# EAGLE board csa_vdc_v1.3e (EAGLE 4.15)
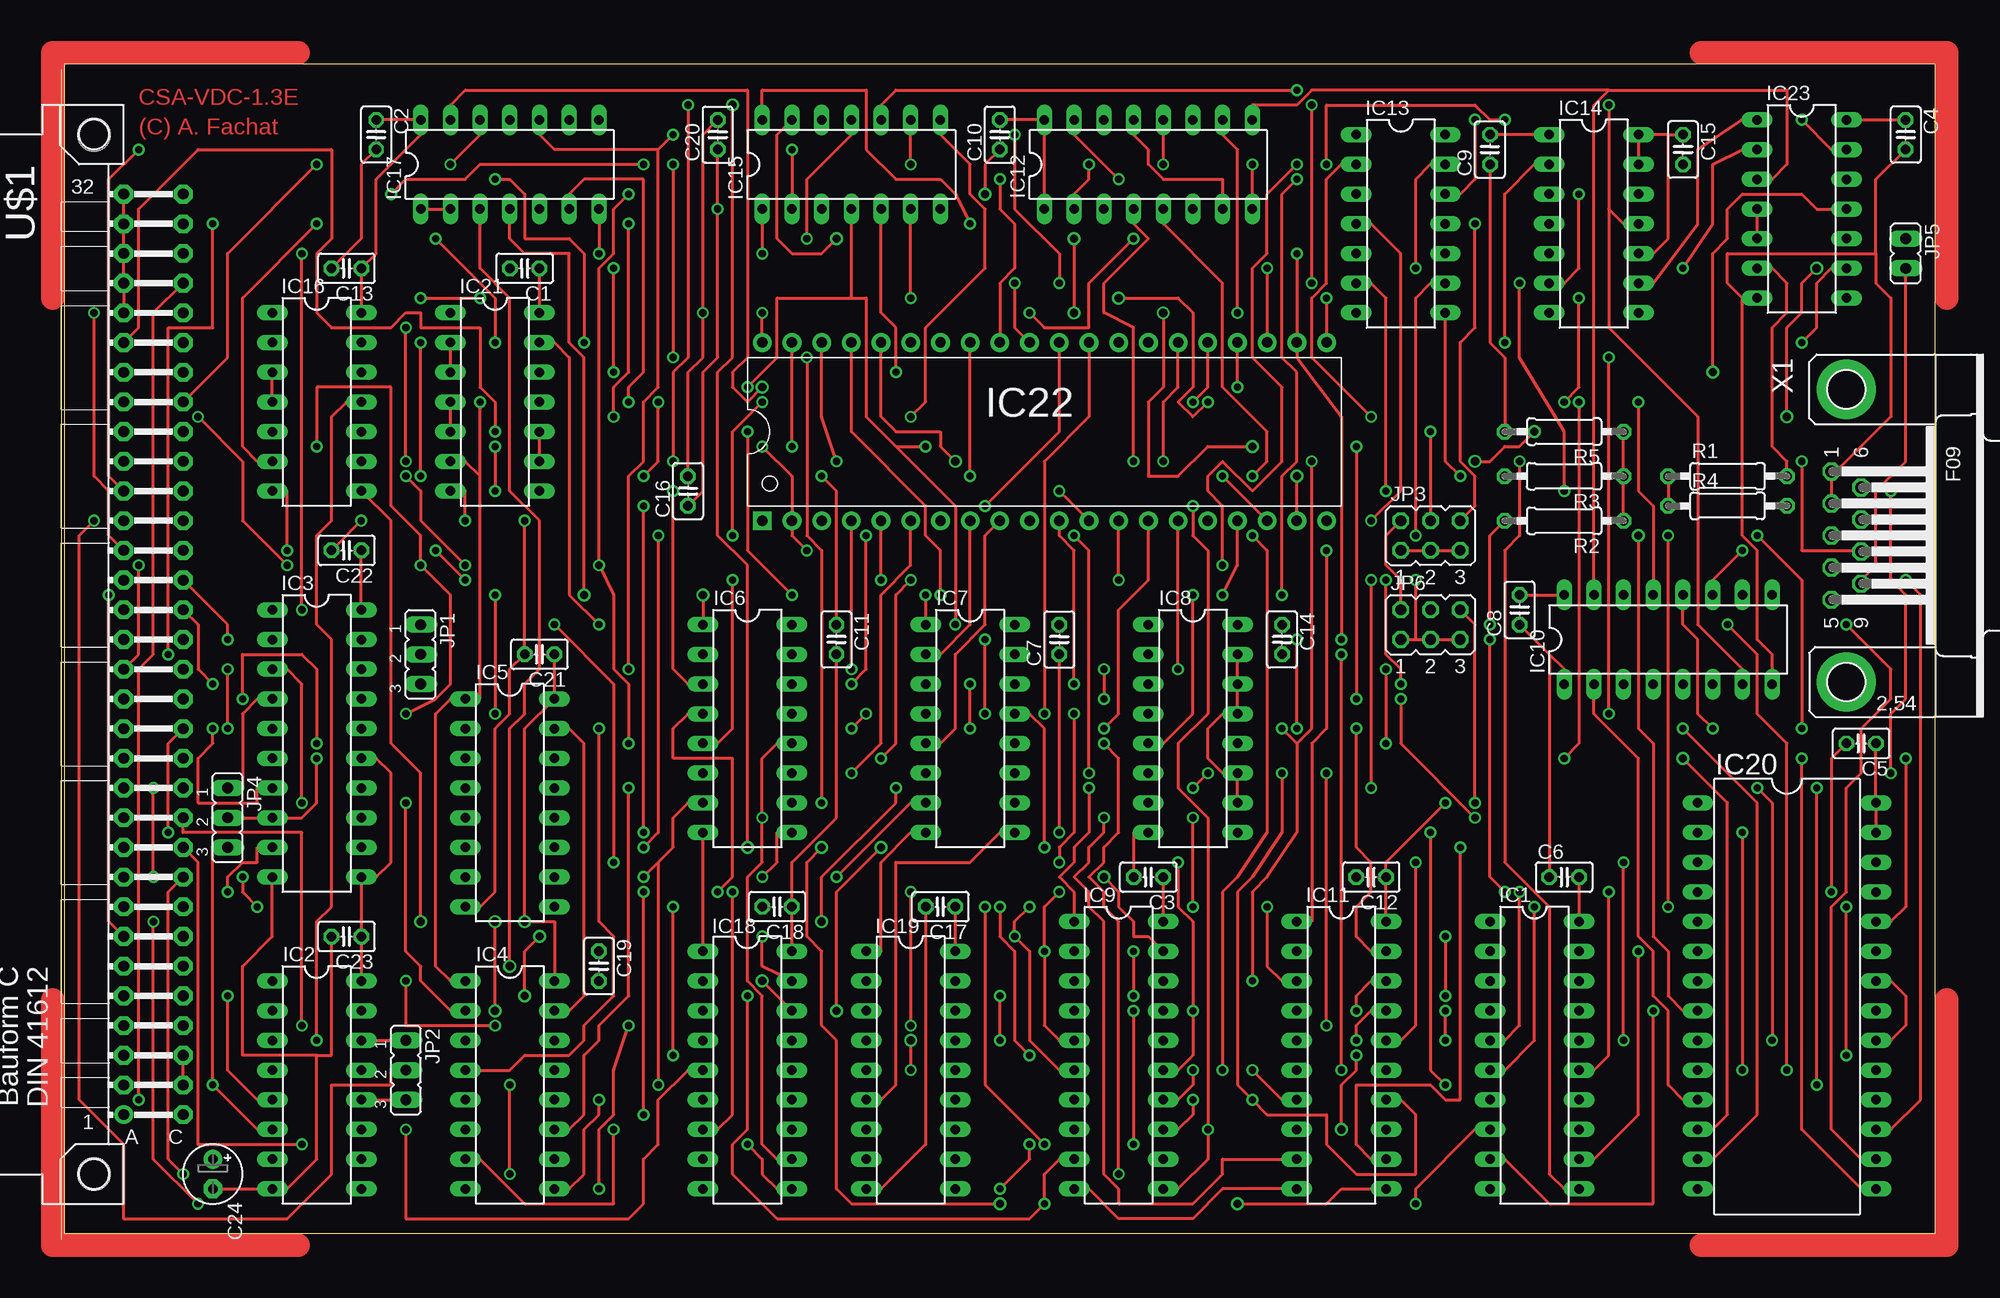
[diagram p1: board, top side]
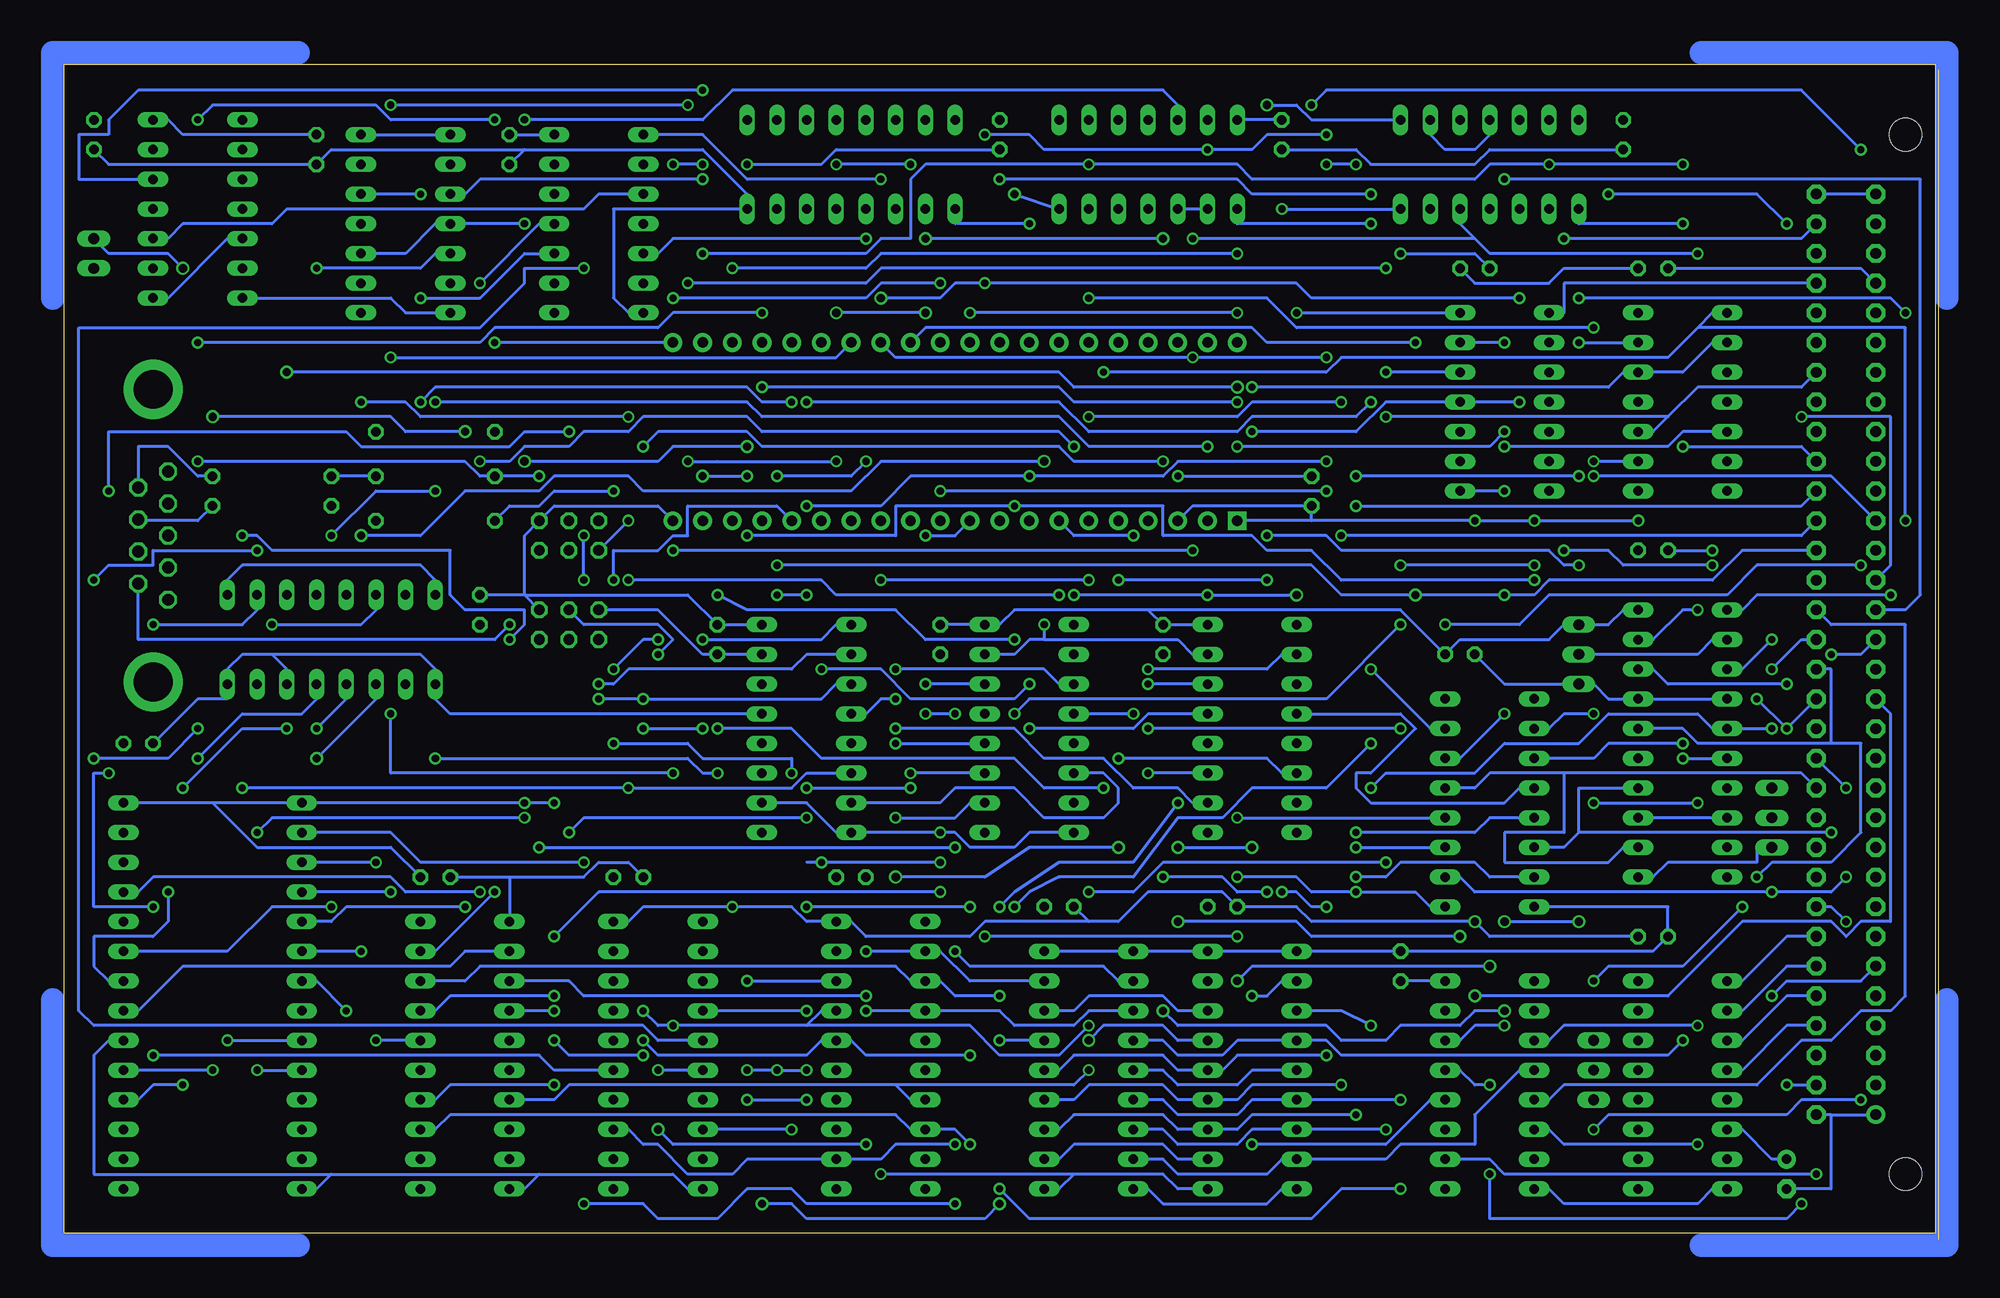
[diagram p2: board, bottom side, seen from below]

Size 160 x 100 mm. Coordinates in mm from the lower left corner, seen from the top.
Outline: 0,0 160,0 160,100 0,100 0,0
Copper layers (1*16): Top 0.035mm / dielectric 1.5mm / Bottom 0.035mm
Design rules "default": minimum track width 10mil, minimum drill 24mil, track to track 8mil, track to pad 8mil, pad to pad 8mil, via to via 8mil, smd to smd 8mil, copper to edge 40mil, drill to drill 8mil, minimum pad ring 10mil, minimum via ring 8mil, stop-mask expansion 4mil, vias tented up to drill 0mil, thermal gap 10mil

## Footprints (pad centres in the part's own frame; a part is rotated, then mirrored left to right if it is on the bottom)
C025-025X050 = drill 0.813 octagon: 1 -1.27,0; 2 1.27,0
E2,5-5 = drill 0.813 pad 1.6 round: + -1.27,0 | drill 0.813 pad 1.6 octagon: - 1.27,0
DIL20 = drill 0.813 long: 1 -11.43,-3.81; 2 -8.89,-3.81; 3 -6.35,-3.81; 4 -3.81,-3.81; 5 -1.27,-3.81; 6 1.27,-3.81; 7 3.81,-3.81; 8 6.35,-3.81; 9 8.89,-3.81; 10 11.43,-3.81; 11 11.43,3.81; 12 8.89,3.81; 13 6.35,3.81; 14 3.81,3.81; 15 1.27,3.81; 16 -1.27,3.81; 17 -3.81,3.81; 18 -6.35,3.81; 19 -8.89,3.81; 20 -11.43,3.81
DIL16 = drill 0.813 long: 1 -8.89,-3.81; 2 -6.35,-3.81; 3 -3.81,-3.81; 4 -1.27,-3.81; 5 1.27,-3.81; 6 3.81,-3.81; 7 6.35,-3.81; 8 8.89,-3.81; 9 8.89,3.81; 10 6.35,3.81; 11 3.81,3.81; 12 1.27,3.81; 13 -1.27,3.81; 14 -3.81,3.81; 15 -6.35,3.81; 16 -8.89,3.81
DIL20' = drill 0.813 long: 1 -10.16,-3.81; 2 -7.62,-3.81; 3 -5.08,-3.81; 4 -2.54,-3.81; 5 0,-3.81; 6 2.54,-3.81; 7 5.08,-3.81; 8 7.62,-3.81; 9 10.16,-3.81; 10 12.7,-3.81; 11 12.7,3.81; 12 10.16,3.81; 13 7.62,3.81; 14 5.08,3.81; 15 2.54,3.81; 16 0,3.81; 17 -2.54,3.81; 18 -5.08,3.81; 19 -7.62,3.81; 20 -10.16,3.81
DIL14 = drill 0.813 long: 1 -7.62,-3.81; 2 -5.08,-3.81; 3 -2.54,-3.81; 4 0,-3.81; 5 2.54,-3.81; 6 5.08,-3.81; 7 7.62,-3.81; 8 7.62,3.81; 9 5.08,3.81; 10 2.54,3.81; 11 0,3.81; 12 -2.54,3.81; 13 -5.08,3.81; 14 -7.62,3.81
DIL18 = drill 0.813 long: 1 -10.16,-3.81; 2 -7.62,-3.81; 3 -5.08,-3.81; 4 -2.54,-3.81; 5 0,-3.81; 6 2.54,-3.81; 7 5.08,-3.81; 8 7.62,-3.81; 9 10.16,-3.81; 10 10.16,3.81; 11 7.62,3.81; 12 5.08,3.81; 13 2.54,3.81; 14 0,3.81; 15 -2.54,3.81; 16 -5.08,3.81; 17 -7.62,3.81; 18 -10.16,3.81
DIL28-6 = drill 0.813 long: 1 -16.51,-7.62; 2 -13.97,-7.62; 3 -11.43,-7.62; 4 -8.89,-7.62; 5 -6.35,-7.62; 6 -3.81,-7.62; 7 -1.27,-7.62; 8 1.27,-7.62; 9 3.81,-7.62; 10 6.35,-7.62; 11 8.89,-7.62; 12 11.43,-7.62; 13 13.97,-7.62; 14 16.51,-7.62; 15 16.51,7.62; 16 13.97,7.62; 17 11.43,7.62; 18 8.89,7.62; 19 6.35,7.62; 20 3.81,7.62; 21 1.27,7.62; 22 -1.27,7.62; 23 -3.81,7.62; 24 -6.35,7.62; 25 -8.89,7.62; 26 -11.43,7.62; 27 -13.97,7.62; 28 -16.51,7.62
DIP40 = drill 0.889 pad 1.6 square: 1 -24.13,-7.62 | drill 0.889 pad 1.6 round: 2 -21.59,-7.62; 3 -19.05,-7.62; 4 -16.51,-7.62; 5 -13.97,-7.62; 6 -11.43,-7.62; 7 -8.89,-7.62; 8 -6.35,-7.62; 9 -3.81,-7.62; 10 -1.27,-7.62; 11 1.27,-7.62; 12 3.81,-7.62; 13 6.35,-7.62; 14 8.89,-7.62; 15 11.43,-7.62; 16 13.97,-7.62; 17 16.51,-7.62; 18 19.05,-7.62; 19 21.59,-7.62; 20 24.13,-7.62; 21 24.13,7.62; 22 21.59,7.62; 23 19.05,7.62; 24 16.51,7.62; 25 13.97,7.62; 26 11.43,7.62; 27 8.89,7.62; 28 6.35,7.62; 29 3.81,7.62; 30 1.27,7.62; 31 -1.27,7.62; 32 -3.81,7.62; 33 -6.35,7.62; 34 -8.89,7.62; 35 -11.43,7.62; 36 -13.97,7.62; 37 -16.51,7.62; 38 -19.05,7.62; 39 -21.59,7.62; 40 -24.13,7.62
JP2 = drill 0.914 long: 1 -2.54,0; 2 0,0; 3 2.54,0
JP3Q = drill 0.914 octagon: 1 -2.54,-1.27; 2 -2.54,1.27; 3 0,-1.27; 4 0,1.27; 5 2.54,-1.27; 6 2.54,1.27
JP1 = drill 0.914 long: 1 0,-1.27; 2 0,1.27
0207/10 = drill 0.813 octagon: 1 -5.08,0; 2 5.08,0
CSABUS = drill 0.914 pad 1.6 round: A1 7.62,36.83 | drill 0.914 pad 1.6 octagon: A2 7.62,34.29; A3 7.62,31.75; A4 7.62,29.21; A5 7.62,26.67; A6 7.62,24.13; A7 7.62,21.59; A8 7.62,19.05; A9 7.62,16.51; A10 7.62,13.97; A11 7.62,11.43; A12 7.62,8.89; A13 7.62,6.35; A14 7.62,3.81; A15 7.62,1.27; A16 7.62,-1.27; A17 7.62,-3.81; A18 7.62,-6.35; A19 7.62,-8.89; A20 7.62,-11.43; A21 7.62,-13.97; A22 7.62,-16.51; A23 7.62,-19.05; A24 7.62,-21.59; A25 7.62,-24.13; A26 7.62,-26.67; A27 7.62,-29.21; A28 7.62,-31.75; A29 7.62,-34.29; A30 7.62,-36.83; A31 7.62,-39.37; A32 7.62,-41.91; C1 2.54,36.83; C2 2.54,34.29; C3 2.54,31.75; C4 2.54,29.21; C5 2.54,26.67; C6 2.54,24.13; C7 2.54,21.59; C8 2.54,19.05; C9 2.54,16.51; C10 2.54,13.97; C11 2.54,11.43; C12 2.54,8.89; C13 2.54,6.35; C14 2.54,3.81; C15 2.54,1.27; C16 2.54,-1.27; C17 2.54,-3.81; C18 2.54,-6.35; C19 2.54,-8.89; C20 2.54,-11.43; C21 2.54,-13.97; C22 2.54,-16.51; C23 2.54,-19.05; C24 2.54,-21.59; C25 2.54,-24.13; C26 2.54,-26.67; C27 2.54,-29.21; C28 2.54,-31.75; C29 2.54,-34.29; C30 2.54,-36.83; C31 2.54,-39.37; C32 2.54,-41.91 | hole 2.794: 10.16,41.91; 10.16,-46.99
F09HP = drill 1.016 octagon: 1 -5.486,-1.27; 2 -2.743,-1.27; 3 0,-1.27; 4 2.743,-1.27; 5 5.486,-1.27; 6 -4.115,1.27; 7 -1.372,1.27; 8 1.372,1.27; 9 4.115,1.27 | drill 3.302 pad 5.08 round: G1 -12.522,0; G2 12.522,0

## Placement (x,y rotation side)
C1  [C025-025X050]  39.37,82.55 180 top
C2  [C025-025X050]  26.67,93.98 270 top
C3  [C025-025X050]  92.71,30.48 180 top
C4  [C025-025X050]  157.48,93.98 270 top
C5  [C025-025X050]  153.67,41.91 180 top
C6  [C025-025X050]  128.27,30.48 0 top
C7  [C025-025X050]  85.09,50.8 90 top
C8  [C025-025X050]  124.46,53.34 90 top
C9  [C025-025X050]  121.92,92.71 90 top
C10  [C025-025X050]  80.01,93.98 90 top
C11  [C025-025X050]  66.04,50.8 270 top
C12  [C025-025X050]  111.76,30.48 180 top
C13  [C025-025X050]  24.13,82.55 180 top
C14  [C025-025X050]  104.14,50.8 270 top
C15  [C025-025X050]  138.43,92.71 270 top
C16  [C025-025X050]  53.34,63.5 90 top
C17  [C025-025X050]  74.93,27.94 180 top
C18  [C025-025X050]  60.96,27.94 180 top
C19  [C025-025X050]  45.72,22.86 270 top
C20  [C025-025X050]  55.88,93.98 90 top
C21  [C025-025X050]  40.64,49.53 180 top
C22  [C025-025X050]  24.13,58.42 180 top
C23  [C025-025X050]  24.13,25.4 180 top
C24  [E2,5-5]  12.7,5.08 270 top
IC1  74HC374N  [DIL20]  125.73,15.24 270 top
IC2  74HCT138N  [DIL16]  21.59,12.7 270 top
IC3  74LS688BUSOPT  [DIL20']  21.59,43.18 270 top
IC4  74HCT257N  [DIL16]  38.1,12.7 270 top
IC5  74HCT257N  [DIL16]  38.1,36.83 270 top
IC6  74HCT257N  [DIL16]  58.42,43.18 270 top
IC7  74HCT257N  [DIL16]  77.47,43.18 270 top
IC8  74HCT257N  [DIL16]  96.52,43.18 270 top
IC9  74HCT245N  [DIL20]  90.17,15.24 270 top
IC10  74HCT166N  [DIL16]  137.16,50.8 0 top
IC11  74LS273BUSOPT  [DIL20']  109.22,16.51 270 top
IC12  74HCT175N  [DIL16]  92.71,91.44 0 top
IC13  74LS86N  [DIL14]  114.3,86.36 270 top
IC14  74HCT74N  [DIL14]  130.81,86.36 270 top
IC15  74HCT04N  [DIL14]  67.31,91.44 0 top
IC16  74HCT00N  [DIL14]  21.59,71.12 270 top
IC17  74LS32N  [DIL14]  38.1,91.44 0 top
IC18  [DIL18]  58.42,13.97 270 top
IC19  [DIL18]  72.39,13.97 270 top
IC20  27C64P  [DIL28-6]  147.32,20.32 270 top
IC21  74HCT04N  [DIL14]  36.83,71.12 270 top
IC22  CRTC6545SMALLPADS  [DIP40]  83.82,68.58 0 top
IC23  74HCT00N  [DIL14]  148.59,87.63 270 top
JP1  [JP2]  30.48,49.53 270 top
JP2  [JP2]  29.21,13.97 270 top
JP3  [JP3Q]  116.84,59.69 0 top
JP4  [JP2]  13.97,35.56 270 top
JP5  [JP1]  157.48,83.82 180 top
JP6  [JP3Q]  116.84,52.07 0 top
R1  10  [0207/10]  142.24,64.77 0 top
R2  47  [0207/10]  128.27,60.96 180 top
R3  47  [0207/10]  128.27,64.77 180 top
R4  220  [0207/10]  142.24,62.23 0 top
R5  220  [0207/10]  128.27,68.58 180 top
U$1  CSABUS  [CSABUS]  12.7,46.99 180 top
X1  [F09HP]  152.4,59.69 270 top

## Tracks (layer width: path | path; a pad name or v marks a point on that pad's centre or on a via)
2PHI2  (via drill 0.61)
  Top 0.254: v29.21,8.89 29.21,1.27 48.26,1.27 49.53,2.54 49.53,6.35 50.8,7.62 50.8,11.43 53.34,13.97 IC18.5 | v6.35,11.43 6.35,48.26 7.62,49.53 7.62,78.74 U$1.C29
  Bottom 0.254: IC18.5 58.42,13.97 59.69,12.7 64.77,12.7 66.04,13.97 IC19.5 | U$1.C29 31.75,81.28 31.75,78.74 IC21.1 | v29.21,8.89 27.94,10.16 12.7,10.16 11.43,11.43 v6.35,11.43
8PHI2  (via drill 0.61)
  Top 0.254: v36.83,76.2 36.83,80.01 v31.75,85.09 | v105.41,90.17 104.14,88.9 104.14,74.93 105.41,73.66 105.41,66.04 104.14,64.77 v104.14,54.61 | v78.74,44.45 v78.74,50.8 | v45.72,52.07 43.18,54.61 43.18,74.93 41.91,76.2 IC21.13
  Bottom 0.254: v31.75,85.09 11.43,85.09 U$1.C31 | v36.83,76.2 IC21.13 | v105.41,90.17 124.46,90.17 125.73,88.9 IC14.3 | v104.14,54.61 101.6,53.34 88.9,53.34 86.36,50.8 v78.74,50.8 | v78.74,44.45 77.47,45.72 52.07,45.72 v45.72,52.07
/8PHI2  (via drill 0.61)
  Top 0.254: v46.99,73.66 v46.99,82.55 | v106.68,81.28 v106.68,96.52 | v132.08,96.52 132.08,87.63 | 132.08,87.63 133.35,86.36 IC14.11 | 132.08,87.63 132.08,77.47 139.7,69.85 139.7,52.07 143.51,48.26 IC10.7
  Bottom 0.254: v46.99,82.55 90.17,82.55 91.44,81.28 v106.68,81.28 | v106.68,96.52 v132.08,96.52 | IC21.12 v46.99,73.66
//PHI2  (via drill 0.61)
  Top 0.254: v124.46,66.04 124.46,59.69 123.19,58.42 123.19,31.75 127,27.94 127,5.08 128.27,3.81 IC1.11 | 71.12,67.31 68.58,69.85 68.58,80.01 67.31,80.01 | v58.42,72.39 60.96,74.93 60.96,80.01 67.31,80.01 | 67.31,80.01 IC15.4 | v76.2,52.07 76.2,62.23 71.12,67.31 | 71.12,67.31 v73.66,67.31
  Bottom 0.254: 76.2,50.8 77.47,50.8 78.74,49.53 IC7.15 | 76.2,50.8 64.77,50.8 63.5,49.53 IC6.15 | IC16.2 19.05,76.2 21.59,73.66 IC16.12 26.67,73.66 27.94,72.39 v58.42,72.39 | v124.46,66.04 121.92,66.04 120.65,67.31 116.84,67.31 115.57,68.58 111.76,68.58 110.49,69.85 101.6,69.85 100.33,68.58 74.93,68.58 v73.66,67.31 | v76.2,52.07 76.2,50.8
/CAS  (via drill 0.7)
  Top 0.254: v59.69,21.59 IC18.16 | v38.1,22.86 38.1,43.18 39.37,44.45 39.37,46.99 40.64,48.26 40.64,60.96 38.1,63.5 38.1,80.01 35.56,82.55 IC17.3
  Bottom 0.254: IC18.16 64.77,19.05 66.04,20.32 72.39,20.32 73.66,19.05 IC19.16 | v59.69,21.59 58.42,22.86 v38.1,22.86
/CPURAM  (via drill 0.7)
  Top 0.254: IC16.8 27.94,60.96 27.94,41.91 30.48,39.37 v30.48,26.67 | v36.83,19.05 v36.83,26.67 | v66.04,19.05 66.04,29.21 v69.85,33.02 | v88.9,30.48 90.17,29.21 90.17,27.94 91.44,26.67 91.44,25.4 92.71,25.4 IC9.19
  Bottom 0.254: v36.83,26.67 v30.48,26.67 | v36.83,19.05 39.37,19.05 40.64,17.78 45.72,17.78 46.99,16.51 50.8,16.51 52.07,17.78 64.77,17.78 v66.04,19.05 | v69.85,33.02 77.47,33.02 81.28,30.48 v88.9,30.48
/GRAPHIC  (via drill 0.61)
  Top 0.254: v120.65,95.25 120.65,90.17 119.38,88.9 IC13.12
  Bottom 0.254: v120.65,95.25 105.41,95.25 102.87,97.79 66.04,97.79 64.77,96.52 IC15.12
/IOSEL  (via drill 0.61)
  Top 0.254: v3.81,54.61 3.81,26.67 U$1.A7
  Bottom 0.254: v3.81,54.61 15.24,54.61 16.51,53.34 IC3.1
/MEMSEL  (via drill 0.61)
  Top 0.254: v13.97,20.32 13.97,13.97 16.51,11.43 IC2.5
  Bottom 0.254: v13.97,20.32 12.7,21.59 6.35,21.59 U$1.A6
/NOCPUACCESS
  Top 0.254: IC16.4 IC16.3
/PHI2  (via drill 0.61)
  Top 0.254: v123.19,76.2 123.19,88.9 125.73,91.44 IC14.2 | IC4.15 43.18,19.05 44.45,20.32 44.45,41.91 43.18,43.18 IC5.15 | 50.8,92.71 41.91,92.71 40.64,93.98 IC17.10 | 50.8,92.71 50.8,72.39 49.53,71.12 49.53,66.04 48.26,64.77 v48.26,48.26 | 50.8,92.71 v52.07,93.98 | v62.23,92.71 IC15.2 | v107.95,80.01 IC22.21 | v85.09,81.28 85.09,83.82 81.28,87.63 v81.28,93.98
  Bottom 0.254: IC22.21 v123.19,76.2 | IC15.2 IC15.3 | v48.26,48.26 43.18,43.18 IC5.15 | v52.07,93.98 57.15,93.98 58.42,92.71 v62.23,92.71 76.2,92.71 77.47,93.98 v81.28,93.98 | v85.09,81.28 90.17,81.28 91.44,80.01 v107.95,80.01
/RAMWE  (via drill 0.61)
  Top 0.254: v21.59,16.51 21.59,26.67 22.86,27.94 22.86,50.8 21.59,52.07 21.59,59.69 22.86,60.96 22.86,69.85 24.13,71.12 IC16.11
  Bottom 0.254: IC19.4 66.04,16.51 64.77,15.24 60.96,15.24 59.69,16.51 IC18.4 52.07,16.51 50.8,15.24 22.86,15.24 v21.59,16.51
/RES  (via drill 0.61)
  Top 0.254: v107.95,58.42 107.95,43.18 106.68,41.91 106.68,26.67 IC11.1 | v63.5,58.42 62.23,59.69 IC22.2 62.23,64.77 v59.69,67.31 | U$1.A27 6.35,77.47 6.35,87.63 11.43,92.71 22.86,92.71 22.86,85.09 21.59,83.82 21.59,78.74 22.86,77.47 27.94,77.47 29.21,78.74 30.48,78.74 30.48,77.47 35.56,77.47 35.56,72.39 36.83,71.12 v36.83,68.58
  Bottom 0.254: v63.5,58.42 v107.95,58.42 | v36.83,68.58 38.1,67.31 v59.69,67.31
/SRLOAD
  Top 0.254: 132.08,97.79 130.81,96.52 IC10.15 | 132.08,97.79 147.32,97.79 147.32,91.44 146.05,90.17 IC23.3 | 132.08,97.79 106.68,97.79 105.41,96.52 101.6,96.52 IC12.9
/VDCIOSEL  (via drill 0.61)
  Top 0.254: v20.32,53.34 v20.32,83.82 | v63.5,85.09 63.5,90.17 67.31,93.98 IC15.11
  Bottom 0.254: v20.32,53.34 21.59,53.34 24.13,50.8 IC3.19 | v20.32,83.82 38.1,83.82 39.37,85.09 | 39.37,85.09 40.64,86.36 IC17.5 | 39.37,85.09 v63.5,85.09
/VDCMEMSEL  (via drill 0.61)
  Top 0.254: v71.12,73.66 71.12,77.47 69.85,78.74 IC15.5 | v2.54,60.96 1.27,59.69 1.27,11.43 5.08,7.62 5.08,1.27 19.05,1.27 22.86,5.08 22.86,12.7 27.94,12.7 27.94,13.97 JP2.2
  Bottom 0.254: 20.32,77.47 22.86,74.93 50.8,74.93 52.07,73.66 v71.12,73.66 | 20.32,77.47 19.05,78.74 IC16.1 | v2.54,60.96 2.54,77.47 20.32,77.47
ADRSEL  (via drill 0.61, 0.7)
  Top 0.254: IC4.1 33.02,21.59 31.75,22.86 31.75,44.45 33.02,45.72 IC5.1 35.56,45.72 35.56,64.77 | 35.56,64.77 34.29,66.04 IC21.6 | 35.56,64.77 v35.56,71.12 | v58.42,68.58 58.42,58.42 v62.23,54.61 | v73.66,54.61 IC7.1 | v54.61,54.61 IC6.1
  Bottom 0.254: v35.56,71.12 IC21.11 46.99,71.12 49.53,68.58 v58.42,68.58 | v73.66,54.61 v62.23,54.61 v54.61,54.61
BA0  (via drill 0.61)
  Top 0.254: v29.21,44.45 31.75,45.72 33.02,46.99 33.02,54.61 v30.48,57.15 30.48,59.69 27.94,62.23 27.94,72.39 21.59,72.39 v21.59,67.31 | v100.33,72.39 IC22.24 | v59.69,71.12 57.15,68.58 v57.15,59.69
  Bottom 0.254: v29.21,44.45 31.75,44.45 33.02,43.18 IC5.2 | v21.59,67.31 11.43,67.31 U$1.C23 | v59.69,71.12 73.66,71.12 74.93,72.39 v100.33,72.39 | v57.15,59.69 52.07,59.69 50.8,58.42 33.02,58.42 31.75,57.15 v30.48,57.15
BA1  (via drill 0.61)
  Top 0.254: v49.53,34.29 v49.53,62.23
  Bottom 0.254: v49.53,34.29 39.37,34.29 38.1,35.56 IC5.5 | v49.53,62.23 11.43,62.23 U$1.C22
BA2  (via drill 0.61)
  Top 0.254: v49.53,33.02 50.8,34.29 v50.8,59.69
  Bottom 0.254: v50.8,59.69 11.43,59.69 U$1.C21 | v49.53,33.02 IC5.11
BA3  (via drill 0.61, 0.7)
  Top 0.254: v36.83,54.61 v36.83,44.45 | IC17.4 38.1,85.09 39.37,83.82 43.18,83.82 43.18,76.2 44.45,74.93 v44.45,54.61 | v148.59,95.25 151.13,92.71 IC23.13 | v123.19,95.25 121.92,95.25 120.65,96.52 107.95,96.52 v107.95,91.44 | v105.41,91.44 102.87,88.9 102.87,83.82 101.6,82.55 101.6,74.93 104.14,72.39 104.14,66.04 101.6,63.5 99.06,66.04 97.79,64.77 97.79,63.5 99.06,62.23 v99.06,57.15
  Bottom 0.254: v36.83,44.45 40.64,40.64 IC5.14 | U$1.C20 16.51,58.42 19.05,55.88 33.02,55.88 34.29,54.61 v36.83,54.61 v44.45,54.61 50.8,54.61 53.34,57.15 v99.06,57.15 | v148.59,95.25 147.32,96.52 133.35,96.52 132.08,95.25 v123.19,95.25 | v105.41,91.44 v107.95,91.44
BA4  (via drill 0.61)
  Top 0.254: v29.21,36.83 29.21,24.13 30.48,22.86 30.48,21.59 33.02,19.05 IC4.2 | v20.32,36.83 20.32,46.99 19.05,48.26 IC3.3 | U$1.C19 13.97,52.07 v13.97,50.8
  Bottom 0.254: v29.21,36.83 v20.32,36.83 | v13.97,50.8 16.51,48.26 IC3.3
BA5  (via drill 0.61)
  Top 0.254: v12.7,46.99 11.43,48.26 11.43,52.07 U$1.C18
  Bottom 0.254: v12.7,46.99 22.86,46.99 24.13,48.26 IC3.18 | U$1.C18 8.89,52.07 2.54,52.07 2.54,20.32 3.81,19.05 6.35,19.05 8.89,16.51 11.43,16.51 15.24,12.7 31.75,12.7 33.02,11.43 IC4.5
BA6  (via drill 0.61)
  Top 0.254: v13.97,43.18 v13.97,48.26 | v48.26,38.1 48.26,20.32 45.72,17.78 45.72,16.51 44.45,15.24 44.45,10.16 43.18,8.89 IC4.11
  Bottom 0.254: v13.97,48.26 11.43,50.8 U$1.C17 | v13.97,43.18 IC3.5 19.05,43.18 20.32,44.45 27.94,44.45 30.48,41.91 36.83,41.91 39.37,39.37 46.99,39.37 v48.26,38.1
BA7  (via drill 0.61)
  Top 0.254: v36.83,17.78 29.21,17.78 v29.21,21.59 | v16.51,27.94 15.24,29.21 v15.24,30.48
  Bottom 0.254: 8.89,41.91 20.32,41.91 21.59,43.18 IC3.16 | 8.89,41.91 8.89,48.26 U$1.C16 | v36.83,17.78 39.37,17.78 40.64,16.51 IC4.14 | v29.21,21.59 27.94,22.86 21.59,22.86 v16.51,27.94 | v15.24,30.48 13.97,31.75 8.89,31.75 6.35,34.29 6.35,41.91 8.89,41.91
BA8  (via drill 0.61)
  Top 0.254: v12.7,43.18 12.7,41.91 11.43,40.64 11.43,36.83 16.51,36.83 16.51,38.1 IC3.7 | v21.59,41.91 21.59,48.26 20.32,49.53 15.24,49.53 v15.24,45.72
  Bottom 0.254: U$1.C15 v12.7,43.18 v15.24,45.72 | v21.59,41.91 27.94,41.91 29.21,40.64 IC5.3
BA9  (via drill 0.61)
  Top 0.254: U$1.C14 8.89,41.91 v8.89,34.29
  Bottom 0.254: 30.48,34.29 31.75,33.02 IC5.6 | IC3.14 30.48,38.1 30.48,34.29 | v8.89,34.29 30.48,34.29
BA10  (via drill 0.61)
  Top 0.254: v13.97,29.21 13.97,30.48 15.24,31.75 16.51,31.75 16.51,33.02 IC3.9 | v7.62,30.48 v7.62,38.1
  Bottom 0.254: IC5.10 40.64,30.48 39.37,29.21 v13.97,29.21 8.89,29.21 v7.62,30.48 | v7.62,38.1 U$1.C13
BA11
  Bottom 0.254: 31.75,39.37 31.75,34.29 36.83,34.29 36.83,31.75 27.94,31.75 26.67,33.02 IC3.12 | 31.75,39.37 38.1,39.37 39.37,38.1 IC5.13 | U$1.C12 11.43,39.37 31.75,39.37
BA12  (via drill 0.61)
  Top 0.254: v20.32,17.78 20.32,34.29 10.16,34.29 U$1.C11
  Bottom 0.254: v20.32,17.78 31.75,17.78 33.02,16.51 IC4.3
BA13  (via drill 0.61)
  Top 0.254: v20.32,7.62 11.43,7.62 11.43,31.75 U$1.C10
  Bottom 0.254: v20.32,7.62 31.75,7.62 33.02,8.89 IC4.6
BA14  (via drill 0.61)
  Top 0.254: v10.16,5.08 8.89,6.35 8.89,29.21 U$1.C9
  Bottom 0.254: v10.16,5.08 36.83,5.08 38.1,6.35 IC4.10
BA15  (via drill 0.61)
  Top 0.254: v38.1,5.08 v38.1,12.7 | v11.43,2.54 7.62,6.35 v7.62,26.67
  Bottom 0.254: v38.1,12.7 39.37,12.7 40.64,13.97 IC4.13 | v38.1,5.08 38.1,1.27 12.7,1.27 v11.43,2.54 | v7.62,26.67 8.89,27.94 U$1.C8
BA16
  Bottom 0.254: U$1.C7 12.7,25.4 16.51,21.59 IC2.1
BA17
  Bottom 0.254: U$1.C6 12.7,22.86 16.51,19.05 IC2.2
BA18
  Bottom 0.254: U$1.C5 12.7,20.32 16.51,16.51 IC2.3
BA19
  Bottom 0.254: U$1.C4 12.7,17.78 16.51,13.97 IC2.4
BD0  (via drill 0.61)
  Top 0.254: IC9.11 95.25,3.81 97.79,6.35 v97.79,8.89 97.79,35.56 95.25,38.1 95.25,41.91 97.79,44.45 97.79,58.42 96.52,59.69 v96.52,62.23 | U$1.A22 3.81,64.77 3.81,90.17 v6.35,92.71 | v53.34,96.52 53.34,74.93 52.07,73.66 v52.07,66.04 | v77.47,64.77 IC22.33
  Bottom 0.254: v97.79,8.89 IC11.8 | v6.35,92.71 11.43,97.79 52.07,97.79 v53.34,96.52 | v52.07,66.04 64.77,66.04 66.04,64.77 v77.47,64.77 87.63,64.77 90.17,62.23 v96.52,62.23
BD1  (via drill 0.61)
  Top 0.254: v29.21,64.77 30.48,63.5 30.48,60.96 v34.29,57.15 | v48.26,88.9 46.99,87.63 46.99,83.82 45.72,82.55 v45.72,57.15 46.99,54.61 46.99,48.26 48.26,46.99 v48.26,41.91 | v80.01,90.17 80.01,87.63 81.28,86.36 81.28,82.55 80.01,81.28 IC22.32 | v83.82,7.62 78.74,12.7 v78.74,27.94
  Bottom 0.254: IC11.13 111.76,8.89 110.49,7.62 109.22,7.62 106.68,5.08 102.87,5.08 101.6,6.35 IC9.12 90.17,6.35 88.9,7.62 v83.82,7.62 | U$1.A21 8.89,64.77 v29.21,64.77 | v34.29,57.15 v45.72,57.15 | v48.26,88.9 58.42,88.9 59.69,90.17 v80.01,90.17 | v78.74,27.94 77.47,29.21 74.93,30.48 68.58,30.48 64.77,35.56 60.96,35.56 58.42,38.1 52.07,38.1 v48.26,41.91
BD2  (via drill 0.61, 0.7)
  Top 0.254: v96.52,11.43 96.52,10.16 95.25,8.89 IC9.13 | IC11.14 114.3,11.43 115.57,10.16 115.57,5.08 110.49,5.08 107.95,7.62 107.95,10.16 102.87,10.16 v101.6,11.43 100.33,12.7 100.33,29.21 101.6,30.48 104.14,34.29 v104.14,39.37 | U$1.A20 3.81,59.69 3.81,63.5 2.54,64.77 v2.54,78.74 | v30.48,80.01 v35.56,80.01 | v81.28,81.28 81.28,77.47 IC22.31 | v128.27,40.64 129.54,41.91 v129.54,71.12 | v90.17,80.01 95.25,80.01 96.52,78.74 96.52,72.39 95.25,71.12 96.52,69.85 v97.79,71.12
  Bottom 0.254: v101.6,11.43 v96.52,11.43 | v2.54,78.74 3.81,80.01 v30.48,80.01 | v35.56,80.01 53.34,80.01 54.61,81.28 v81.28,81.28 83.82,81.28 85.09,80.01 v90.17,80.01 | v104.14,39.37 105.41,39.37 106.68,40.64 v128.27,40.64 | v129.54,71.12 128.27,72.39 101.6,72.39 100.33,71.12 v97.79,71.12
BD3  (via drill 0.61)
  Top 0.254: v96.52,13.97 96.52,12.7 95.25,11.43 IC9.14 | v101.6,13.97 104.14,11.43 IC11.7 | v11.43,69.85 15.24,66.04 15.24,60.96 v19.05,57.15 | v31.75,58.42 v34.29,55.88 | v78.74,62.23 85.09,68.58 IC22.30 | v101.6,59.69 102.87,58.42 102.87,34.29 100.33,30.48 99.06,29.21 v99.06,13.97
  Bottom 0.254: v96.52,13.97 v99.06,13.97 v101.6,13.97 | U$1.A19 3.81,57.15 3.81,69.85 v11.43,69.85 | v19.05,57.15 26.67,57.15 27.94,58.42 v31.75,58.42 | v34.29,55.88 50.8,55.88 53.34,58.42 57.15,58.42 58.42,59.69 66.04,59.69 66.04,62.23 v78.74,62.23 88.9,62.23 88.9,59.69 v101.6,59.69
BD4  (via drill 0.61)
  Top 0.254: IC9.15 95.25,13.97 96.52,15.24 v96.52,19.05 96.52,26.67 95.25,27.94 v95.25,31.75 | v36.83,90.17 38.1,90.17 39.37,88.9 39.37,85.09 43.18,85.09 44.45,83.82 v44.45,76.2 | v86.36,44.45 86.36,34.29 85.09,33.02 v85.09,31.75 | v83.82,44.45 83.82,66.04 87.63,69.85 IC22.29
  Bottom 0.254: v96.52,19.05 IC11.4 | U$1.A18 2.54,53.34 1.27,54.61 1.27,90.17 v36.83,90.17 | v44.45,76.2 57.15,76.2 58.42,77.47 86.36,77.47 IC22.29 | 96.52,31.75 v95.25,31.75 v85.09,31.75 | v83.82,44.45 v86.36,44.45
BD5  (via drill 0.61)
  Top 0.254: v110.49,16.51 110.49,17.78 111.76,19.05 IC11.17 | v8.89,49.53 8.89,77.47 12.7,77.47 v12.7,86.36 | v27.94,88.9 29.21,90.17 34.29,90.17 35.56,91.44 v49.53,91.44 | v52.07,91.44 v52.07,74.93 | v82.55,15.24 81.28,16.51 81.28,24.13 80.01,25.4 v80.01,27.94 | v64.77,36.83 64.77,58.42 63.5,59.69 v63.5,74.93
  Bottom 0.254: v110.49,16.51 109.22,15.24 96.52,15.24 95.25,16.51 IC9.16 92.71,16.51 91.44,15.24 v82.55,15.24 | U$1.A17 6.35,49.53 v8.89,49.53 | v12.7,86.36 15.24,88.9 v27.94,88.9 | v49.53,91.44 v52.07,91.44 | v52.07,74.93 v63.5,74.93 88.9,74.93 IC22.28 | v80.01,27.94 78.74,29.21 74.93,31.75 68.58,31.75 v64.77,36.83
BD6  (via drill 0.61)
  Top 0.254: v110.49,19.05 110.49,20.32 111.76,21.59 IC11.18 | U$1.A16 6.35,49.53 v6.35,57.15 | v41.91,52.07 46.99,46.99 v46.99,31.75 | v72.39,29.21 v72.39,17.78 | v132.08,44.45 v132.08,74.93 | v107.95,17.78 v107.95,39.37
  Bottom 0.254: 96.52,17.78 95.25,19.05 IC9.17 | 96.52,17.78 v107.95,17.78 109.22,17.78 v110.49,19.05 | v6.35,57.15 15.24,57.15 17.78,54.61 33.02,54.61 35.56,52.07 v41.91,52.07 | v46.99,31.75 66.04,31.75 68.58,29.21 v72.39,29.21 | v72.39,17.78 74.93,15.24 80.01,15.24 82.55,17.78 96.52,17.78 | IC22.27 93.98,74.93 v132.08,74.93 | v132.08,44.45 132.08,39.37 v107.95,39.37
BD7  (via drill 0.61, 0.7)
  Top 0.254: 105.41,41.91 106.68,43.18 v106.68,66.04 | v93.98,66.04 93.98,71.12 95.25,72.39 IC22.26 | v71.12,38.1 71.12,36.83 64.77,30.48 v64.77,26.67 | v104.14,43.18 105.41,41.91 | v101.6,21.59 101.6,29.21 102.87,30.48 105.41,34.29 105.41,41.91 | v39.37,20.32 39.37,24.13 v40.64,25.4
  Bottom 0.254: v106.68,66.04 104.14,66.04 v93.98,66.04 | v101.6,21.59 IC9.18 | U$1.A15 3.81,44.45 3.81,26.67 6.35,26.67 7.62,25.4 8.89,26.67 16.51,26.67 22.86,20.32 v39.37,20.32 | v71.12,38.1 76.2,38.1 78.74,40.64 95.25,40.64 97.79,43.18 v104.14,43.18 | v40.64,25.4 53.34,25.4 54.61,26.67 v64.77,26.67
CA3  (via drill 0.61)
  Top 0.254: v135.89,19.05 135.89,2.54 127,2.54 123.19,6.35 IC1.9
  Bottom 0.254: v135.89,19.05 138.43,21.59 IC20.7
CA4  (via drill 0.61)
  Top 0.254: v134.62,24.13 134.62,10.16 130.81,6.35 IC1.12
  Bottom 0.254: v134.62,24.13 IC20.6
CA5  (via drill 0.61)
  Top 0.254: v125.73,27.94 125.73,16.51 123.19,13.97 IC1.6
  Bottom 0.254: v125.73,27.94 135.89,27.94 137.16,26.67 IC20.5
CA6  (via drill 0.61)
  Top 0.254: v132.08,29.21 132.08,15.24 130.81,13.97 IC1.15
  Bottom 0.254: v132.08,29.21 IC20.4
CA7  (via drill 0.61)
  Top 0.254: v133.35,16.51 v133.35,31.75
  Bottom 0.254: IC1.16 v133.35,16.51 | v133.35,31.75 IC20.3
CA8  (via drill 0.61)
  Top 0.254: v124.46,29.21 124.46,17.78 123.19,16.51 IC1.5
  Bottom 0.254: v124.46,29.21 130.81,29.21 132.08,30.48 152.4,30.48 153.67,29.21 IC20.25
CA9  (via drill 0.61)
  Top 0.254: v123.19,29.21 121.92,30.48 v121.92,50.8 | v144.78,59.69 148.59,55.88 v148.59,43.18 | v157.48,40.64 157.48,27.94 156.21,26.67 IC20.24
  Bottom 0.254: v123.19,29.21 128.27,24.13 IC1.19 | v121.92,50.8 120.65,52.07 120.65,53.34 125.73,53.34 127,54.61 127,58.42 142.24,58.42 143.51,59.69 v144.78,59.69 | v148.59,43.18 151.13,40.64 v157.48,40.64
CA10
  Bottom 0.254: IC1.2 125.73,24.13 127,22.86 149.86,22.86 153.67,19.05 IC20.21
CA11  (via drill 0.61)
  Top 0.254: v137.16,27.94 v137.16,59.69 | v128.27,63.5 128.27,68.58 124.46,74.93 v124.46,81.28
  Bottom 0.254: v137.16,27.94 142.24,27.94 146.05,24.13 IC20.23 | v137.16,59.69 133.35,63.5 v128.27,63.5 | v124.46,81.28 119.38,86.36 IC13.11
CA12  (via drill 0.61)
  Top 0.254: v115.57,31.75 115.57,17.78 114.3,16.51 IC11.16
  Bottom 0.254: v115.57,31.75 129.54,31.75 132.08,34.29 IC20.2
COMPOSITE
  Bottom 0.254: R4.2 148.59,60.96 153.67,60.96 X1.7
CURSOR_DELAYED  (via drill 0.61)
  Top 0.254: v90.17,90.17 86.36,93.98 IC12.15
  Bottom 0.254: v90.17,90.17 101.6,90.17 105.41,93.98 IC13.1
DISPEN_DELAYED  (via drill 0.61)
  Top 0.254: v100.33,78.74 100.33,92.71 99.06,93.98 IC12.10 | v148.59,76.2 149.86,77.47 149.86,81.28 151.13,82.55 IC23.9
  Bottom 0.254: v100.33,78.74 107.95,78.74 109.22,77.47 123.19,77.47 124.46,76.2 v148.59,76.2
GND  (via drill 0.61, 0.7)
  Top 0.254: C10.1 78.74,91.44 v78.74,88.9 | 151.13,64.77 X1.2 151.13,62.23 | R5.2 123.19,74.93 121.92,76.2 C9.1 | 151.13,64.77 156.21,69.85 156.21,80.01 154.94,81.28 154.94,83.82 | 154.94,83.82 154.94,90.17 C4.2 | 151.13,64.77 X1.1 | IC12.8 v101.6,91.44 | 143.51,80.01 142.24,81.28 142.24,83.82 154.94,83.82 | v19.05,58.42 19.05,63.5 IC16.7 | v34.29,60.96 34.29,63.5 IC21.7 | v25.4,60.96 C22.2 | U$1.A28 U$1.A29 U$1.A30 U$1.A31 U$1.A32 | IC17.7 v45.72,83.82 | C13.2 25.4,85.09 25.4,91.44 C2.2 | C20.1 v55.88,87.63 55.88,74.93 54.61,73.66 54.61,63.5 C16.1 | IC20.20 156.21,16.51 157.48,17.78 157.48,20.32 156.21,21.59 IC20.22 | IC9.10 87.63,3.81 90.17,1.27 96.52,1.27 99.06,3.81 IC11.10 | 127,49.53 C8.1 | 127,49.53 128.27,48.26 IC10.1 | 127,49.53 C6.1 | C3.2 91.44,34.29 IC8.8 | v85.09,34.29 C7.1 | IC8.10 IC8.11 99.06,39.37 97.79,40.64 97.79,43.18 99.06,44.45 IC8.13 IC8.14 IC8.15 | JP3.2 113.03,59.69 113.03,57.15 114.3,55.88 JP6.2 | JP4.1 15.24,38.1 15.24,44.45 16.51,45.72 IC3.4 | C24.- IC2.8 19.05,3.81 21.59,6.35 21.59,15.24 | IC3.10 17.78,25.4 15.24,22.86 15.24,15.24 21.59,15.24 | 21.59,15.24 22.86,15.24 C23.2 | IC18.1 IC6.8 | IC19.18 C17.1 | IC18.18 C18.1 62.23,31.75 66.04,35.56 C11.2 | IC7.8 72.39,34.29 69.85,31.75 69.85,24.13 IC19.1 | IC5.8 35.56,27.94 36.83,29.21 36.83,43.18 38.1,44.45 38.1,48.26 C21.2 v39.37,60.96 | v151.13,29.21 151.13,40.64 C5.2 | 143.51,80.01 143.51,59.69 144.78,58.42 144.78,50.8 146.05,49.53 IC10.8 | 143.51,80.01 IC23.7
  Bottom 0.254: IC14.7 130.81,78.74 132.08,80.01 IC23.7 | 120.65,92.71 105.41,92.71 101.6,88.9 IC12.8 113.03,87.63 113.03,80.01 111.76,78.74 IC13.7 | 120.65,92.71 C9.1 | 120.65,92.71 137.16,92.71 C15.2 156.21,91.44 C4.2 | v101.6,91.44 95.25,91.44 93.98,92.71 C10.1 | C22.2 v19.05,58.42 | 53.34,60.96 IC22.1 | 53.34,60.96 v39.37,60.96 v34.29,60.96 v25.4,60.96 | 53.34,60.96 C16.1 63.5,62.23 IC22.3 | U$1.A32 U$1.C32 | C1.2 39.37,83.82 v45.72,83.82 | C20.1 49.53,92.71 48.26,91.44 39.37,91.44 38.1,92.71 C2.2 | v55.88,87.63 IC17.7 | U$1.A29 6.35,82.55 C13.2 | 119.38,5.08 120.65,3.81 IC1.10 | 119.38,5.08 107.95,5.08 106.68,3.81 IC11.10 | 137.16,5.08 138.43,3.81 IC20.14 | 137.16,5.08 119.38,5.08 | 137.16,5.08 157.48,5.08 157.48,15.24 156.21,16.51 IC20.20 | 121.92,30.48 IC1.1 | C6.1 121.92,30.48 | C12.2 111.76,31.75 114.3,31.75 115.57,30.48 121.92,30.48 | 142.24,49.53 140.97,48.26 IC10.6 | 142.24,49.53 144.78,49.53 146.05,48.26 IC10.8 146.05,45.72 148.59,45.72 C5.2 | 142.24,49.53 129.54,49.53 128.27,48.26 IC10.1 128.27,45.72 127,44.45 IC8.13 | IC8.15 C14.2 105.41,49.53 109.22,53.34 JP6.2 | IC8.10 96.52,36.83 93.98,34.29 IC8.8 v85.09,34.29 83.82,34.29 82.55,33.02 78.74,33.02 77.47,34.29 IC7.8 | C21.2 36.83,46.99 JP1.3 29.21,46.99 27.94,45.72 IC3.17 IC3.4 | 8.89,10.16 U$1.C1 | 8.89,10.16 U$1.A1 | IC4.8 33.02,3.81 31.75,2.54 20.32,2.54 19.05,3.81 IC2.8 | 8.89,10.16 8.89,3.81 C24.- | IC5.8 22.86,27.94 C23.2 24.13,24.13 C19.1 IC18.1 IC18.18 IC19.1 IC19.18 | v151.13,29.21 151.13,26.67 152.4,25.4 157.48,25.4 157.48,22.86 156.21,21.59 IC20.22 | v78.74,88.9 IC15.7
GRAPHIC  (via drill 0.7)
  Top 0.254: IC15.13 60.96,93.98 60.96,85.09 62.23,83.82 64.77,83.82 v66.04,85.09 | v86.36,85.09 v86.36,78.74 | v93.98,78.74 93.98,72.39 92.71,71.12 92.71,64.77 95.25,64.77 97.79,67.31 v101.6,67.31 | v120.65,66.04 121.92,66.04 123.19,67.31 124.46,67.31 v125.73,68.58 | v147.32,69.85 147.32,77.47 148.59,78.74 148.59,81.28 v149.86,82.55
  Bottom 0.254: v66.04,85.09 v86.36,85.09 | v86.36,78.74 v93.98,78.74 | v101.6,67.31 107.95,67.31 109.22,66.04 v120.65,66.04 | v125.73,68.58 130.81,68.58 132.08,69.85 v147.32,69.85 | v149.86,82.55 151.13,83.82 156.21,83.82 JP5.1
GRPH  (via drill 0.61)
  Top 0.254: v115.57,82.55 115.57,90.17 116.84,91.44 IC13.13
  Bottom 0.254: v115.57,82.55 120.65,82.55 120.65,81.28 124.46,77.47 158.75,77.47 158.75,19.05 157.48,17.78 110.49,17.78 109.22,16.51 IC11.5
HIRES  (via drill 0.61)
  Top 0.254: v105.41,43.18 v105.41,50.8 | v110.49,43.18 110.49,33.02 111.76,31.75 111.76,29.21 110.49,27.94 110.49,25.4 111.76,24.13 IC11.19
  Bottom 0.254: v105.41,50.8 95.25,50.8 93.98,52.07 IC8.1 | v110.49,43.18 v105.41,43.18
HSINV  (via drill 0.61)
  Top 0.254: v109.22,13.97 v109.22,49.53
  Bottom 0.254: v109.22,49.53 107.95,50.8 109.22,52.07 115.57,52.07 JP6.4 | IC11.6 v109.22,13.97
HSYNC  (via drill 0.61)
  Top 0.254: v119.38,64.77 118.11,66.04 IC13.8 | v148.59,66.04 148.59,58.42 153.67,58.42 X1.8
  Bottom 0.254: v119.38,64.77 R3.2 124.46,64.77 125.73,66.04 v148.59,66.04
MA0  (via drill 0.61)
  Top 0.254: v52.07,15.24 v52.07,27.94 | v55.88,29.21 57.15,30.48 57.15,40.64 52.07,40.64 52.07,43.18 53.34,44.45 IC6.4
  Bottom 0.254: IC19.14 74.93,13.97 73.66,15.24 66.04,15.24 64.77,13.97 IC18.14 60.96,13.97 59.69,15.24 v52.07,15.24 | IC5.4 35.56,38.1 36.83,36.83 48.26,36.83 49.53,38.1 49.53,39.37 48.26,39.37 44.45,43.18 45.72,44.45 IC6.4 | v52.07,27.94 53.34,27.94 54.61,29.21 v55.88,29.21
MA1  (via drill 0.61)
  Top 0.254: 50.8,31.75 52.07,33.02 52.07,35.56 53.34,36.83 IC6.7 | v49.53,30.48 50.8,31.75 | 50.8,31.75 v50.8,12.7
  Bottom 0.254: IC19.13 73.66,11.43 72.39,12.7 66.04,12.7 64.77,11.43 IC18.13 59.69,11.43 58.42,12.7 v50.8,12.7 | v49.53,30.48 46.99,30.48 45.72,31.75 39.37,31.75 38.1,30.48 IC5.7
MA2  (via drill 0.61)
  Top 0.254: v59.69,30.48 60.96,31.75 60.96,34.29 IC6.9 | v49.53,10.16 v49.53,29.21
  Bottom 0.254: IC19.12 74.93,8.89 73.66,10.16 66.04,10.16 64.77,8.89 IC18.12 59.69,8.89 58.42,10.16 v49.53,10.16 | v59.69,30.48 54.61,30.48 53.34,29.21 v49.53,29.21 44.45,29.21 43.18,27.94 IC5.9
MA3  (via drill 0.61)
  Top 0.254: IC6.12 60.96,41.91 59.69,40.64 v59.69,35.56 59.69,31.75 58.42,30.48 58.42,21.59 59.69,20.32 59.69,7.62 60.96,6.35 IC18.11
  Bottom 0.254: IC18.11 64.77,6.35 66.04,7.62 73.66,7.62 74.93,6.35 IC19.11 | v59.69,35.56 IC5.12
MA4  (via drill 0.61)
  Top 0.254: v67.31,43.18 v68.58,44.45 | 35.56,13.97 IC4.4 38.1,13.97 39.37,15.24 43.18,15.24 44.45,16.51 44.45,17.78 46.99,20.32 46.99,25.4 45.72,26.67 v45.72,43.18
  Bottom 0.254: IC19.8 66.04,6.35 64.77,5.08 57.15,5.08 55.88,6.35 IC18.8 46.99,6.35 45.72,7.62 39.37,7.62 39.37,10.16 35.56,13.97 IC4.4 | v45.72,43.18 v67.31,43.18 | v68.58,44.45 IC7.4
MA5  (via drill 0.61)
  Top 0.254: v46.99,8.89 46.99,2.54 39.37,2.54 35.56,6.35 IC4.7 | v66.04,30.48 72.39,36.83 IC7.7 | v57.15,29.21 57.15,10.16 55.88,8.89 IC18.7
  Bottom 0.254: v46.99,8.89 IC18.7 58.42,8.89 59.69,7.62 64.77,7.62 66.04,8.89 IC19.7 | v66.04,30.48 60.96,30.48 59.69,29.21 v57.15,29.21
MA6  (via drill 0.61)
  Top 0.254: v45.72,11.43 45.72,10.16 44.45,8.89 44.45,5.08 43.18,3.81 IC4.9 | IC7.9 80.01,34.29 77.47,31.75 71.12,31.75 71.12,12.7 69.85,11.43 IC19.6
  Bottom 0.254: v45.72,11.43 IC18.6 58.42,11.43 59.69,10.16 64.77,10.16 66.04,11.43 IC19.6
MA7  (via drill 0.61)
  Top 0.254: v58.42,7.62 59.69,6.35 59.69,5.08 60.96,3.81 IC18.10 | v88.9,41.91 90.17,40.64 90.17,34.29 88.9,33.02 88.9,31.75 87.63,30.48 88.9,29.21 88.9,27.94 90.17,26.67 v90.17,5.08
  Bottom 0.254: 73.66,5.08 66.04,5.08 64.77,3.81 IC18.10 | 73.66,5.08 74.93,3.81 IC19.10 | v58.42,7.62 46.99,7.62 43.18,11.43 IC4.12 | 73.66,5.08 v90.17,5.08 | v88.9,41.91 IC7.12
MD0  (via drill 0.61)
  Top 0.254: v58.42,20.32 58.42,8.89 57.15,7.62 57.15,5.08 60.96,1.27 82.55,1.27 v83.82,2.54 83.82,5.08 85.09,6.35 IC9.9 | v115.57,2.54 115.57,3.81 120.65,8.89 IC1.8
  Bottom 0.254: v58.42,20.32 57.15,20.32 55.88,21.59 IC18.2 | v83.82,2.54 96.52,2.54 97.79,3.81 101.6,3.81 104.14,1.27 109.22,1.27 110.49,2.54 v115.57,2.54
MD1  (via drill 0.61)
  Top 0.254: v48.26,17.78 46.99,13.97 46.99,10.16 45.72,8.89 v45.72,3.81 | v80.01,3.81 82.55,6.35 v82.55,7.62
  Bottom 0.254: IC1.13 128.27,8.89 127,10.16 88.9,10.16 87.63,8.89 IC9.8 83.82,8.89 v82.55,7.62 | v48.26,17.78 50.8,19.05 IC18.3 | v45.72,3.81 50.8,3.81 53.34,1.27 77.47,1.27 v80.01,3.81
MD2  (via drill 0.61, 0.7)
  Top 0.254: v72.39,16.51 v72.39,13.97
  Bottom 0.254: 88.9,12.7 87.63,11.43 IC9.7 | 88.9,12.7 116.84,12.7 118.11,11.43 IC1.7 | v72.39,13.97 73.66,12.7 88.9,12.7 | IC18.15 64.77,16.51 66.04,17.78 71.12,17.78 v72.39,16.51
MD3  (via drill 0.61)
  Top 0.254: IC18.17 59.69,22.86 v59.69,25.4 | IC9.6 85.09,13.97 82.55,16.51 82.55,24.13 v81.28,25.4 81.28,26.67 v82.55,27.94 | v118.11,12.7 116.84,13.97 v116.84,34.29 | v96.52,27.94 v96.52,35.56
  Bottom 0.254: v59.69,25.4 v81.28,25.4 | v118.11,12.7 127,12.7 128.27,11.43 IC1.14 | v116.84,34.29 115.57,35.56 v96.52,35.56 | v82.55,27.94 v96.52,27.94
MD4  (via drill 0.61)
  Top 0.254: IC9.5 85.09,16.51 83.82,17.78 v83.82,24.13 83.82,27.94 v85.09,29.21 | v118.11,25.4 v118.11,20.32
  Bottom 0.254: v83.82,24.13 82.55,22.86 71.12,22.86 69.85,21.59 IC19.2 | v118.11,20.32 127,20.32 128.27,19.05 IC1.17 | v118.11,25.4 114.3,29.21 v85.09,29.21
MD5  (via drill 0.61, 0.7)
  Top 0.254: v118.11,16.51 v118.11,19.05 | v110.49,15.24 110.49,13.97 109.22,12.7 v109.22,8.89 | v91.44,19.05 v91.44,7.62
  Bottom 0.254: IC19.3 72.39,19.05 73.66,17.78 78.74,17.78 80.01,19.05 IC9.4 v91.44,19.05 | v118.11,16.51 116.84,15.24 v110.49,15.24 | v118.11,19.05 IC1.4 | v91.44,7.62 107.95,7.62 v109.22,8.89
MD6  (via drill 0.61)
  Top 0.254: v80.01,16.51 v80.01,20.32
  Bottom 0.254: v80.01,20.32 83.82,20.32 85.09,21.59 IC9.3 87.63,21.59 88.9,22.86 124.46,22.86 125.73,21.59 IC1.18 | IC19.15 v80.01,16.51
MD7  (via drill 0.61)
  Top 0.254: v91.44,24.13 v91.44,20.32
  Bottom 0.254: IC19.17 82.55,21.59 85.09,24.13 IC9.2 v91.44,24.13 | v91.44,20.32 115.57,20.32 116.84,21.59 IC1.3
N$1
  Top 2: 20,-1 -1,-1 -1,20
N$2
  Top 2: 140,-1 161,-1 161,20
N$3
  Top 2: 20,101 -1,101 -1,80
N$4
  Top 2: 161,80 161,101 140,101
N$5
  Bottom 2: 20,-1 -1,-1 -1,20
N$6
  Bottom 2: 140,-1 161,-1 161,20
N$7
  Bottom 2: 20,101 -1,101 -1,80
N$8
  Bottom 2: 161,80 161,101 140,101
N$9  (via drill 0.61)
  Top 0.254: v88.9,48.26 v88.9,45.72
  Bottom 0.254: v88.9,45.72 90.17,45.72 91.44,44.45 IC8.4 | v88.9,48.26 76.2,48.26 74.93,46.99 IC7.3
N$10
  Bottom 0.254: IC3.2 19.05,50.8 20.32,49.53 JP1.2
N$11
  Bottom 0.254: IC8.7 85.09,36.83 83.82,38.1 78.74,38.1 76.2,35.56 71.12,35.56 69.85,36.83 69.85,38.1 71.12,39.37 IC7.6
N$12
  Top 0.254: IC20.11 138.43,11.43 137.16,12.7 137.16,19.05 135.89,20.32 135.89,24.13 134.62,25.4 134.62,40.64 130.81,44.45 IC10.2
N$13  (via drill 0.7)
  Top 0.254: IC20.12 140.97,8.89 142.24,10.16 142.24,36.83 v138.43,40.64
  Bottom 0.254: v138.43,40.64 133.35,45.72 IC10.3
N$14  (via drill 0.61)
  Top 0.254: v138.43,43.18 144.78,36.83 144.78,10.16 140.97,6.35 IC20.13
  Bottom 0.254: v138.43,43.18 135.89,45.72 IC10.4
N$15  (via drill 0.61)
  Top 0.254: v148.59,40.64 148.59,8.89 153.67,3.81 IC20.15
  Bottom 0.254: v148.59,40.64 144.78,44.45 139.7,44.45 138.43,45.72 IC10.5
N$16  (via drill 0.61)
  Top 0.254: v152.4,52.07 156.21,48.26 156.21,45.72 153.67,43.18 153.67,39.37 152.4,38.1 152.4,29.21 151.13,27.94 151.13,8.89 153.67,6.35 IC20.16
  Bottom 0.254: v152.4,52.07 144.78,52.07 143.51,53.34 IC10.10
N$17  (via drill 0.61)
  Top 0.254: v157.48,55.88 158.75,54.61 158.75,11.43 156.21,8.89 IC20.17 | v143.51,58.42 140.97,55.88 IC10.11
  Bottom 0.254: v157.48,55.88 156.21,57.15 152.4,57.15 152.4,58.42 v143.51,58.42
N$18  (via drill 0.61)
  Top 0.254: v149.86,12.7 v149.86,38.1 | v140.97,43.18 139.7,44.45 139.7,50.8 138.43,52.07 IC10.12
  Bottom 0.254: v149.86,12.7 152.4,12.7 153.67,11.43 IC20.18 | v149.86,38.1 144.78,43.18 v140.97,43.18
N$19  (via drill 0.61)
  Top 0.254: v147.32,13.97 147.32,41.91 144.78,44.45 144.78,49.53 v142.24,52.07
  Bottom 0.254: v142.24,52.07 134.62,52.07 133.35,53.34 IC10.14 | v147.32,13.97 IC20.19
N$20
  Top 0.254: IC2.14 JP2.1
N$21
  Top 0.254: IC2.12 JP2.3
N$22  (via drill 0.61)
  Top 0.254: v138.43,82.55 140.97,86.36 140.97,91.44 143.51,92.71 IC23.2
  Bottom 0.254: v138.43,82.55 129.54,82.55 128.27,83.82 IC14.5
N$23
  Top 0.254: IC14.9 135.89,81.28 139.7,86.36 139.7,92.71 143.51,95.25 IC23.1
N$24  (via drill 0.7)
  Top 0.254: v57.15,96.52 57.15,74.93 55.88,73.66 55.88,59.69 58.42,57.15 v58.42,33.02 | IC11.11 109.22,3.81 107.95,2.54 v100.33,2.54 | v80.01,2.54 67.31,2.54 66.04,3.81 66.04,16.51 64.77,17.78 64.77,24.13 63.5,25.4 63.5,31.75 v64.77,33.02
  Bottom 0.254: IC17.8 53.34,95.25 54.61,96.52 v57.15,96.52 | v100.33,2.54 97.79,2.54 96.52,1.27 81.28,1.27 v80.01,2.54 | v64.77,33.02 v58.42,33.02
N$25  (via drill 0.61)
  Top 0.254: v91.44,66.04 91.44,77.47 88.9,78.74 88.9,81.28 92.71,85.09 91.44,86.36 IC12.4 | v99.06,64.77 IC22.18
  Bottom 0.254: v91.44,66.04 92.71,64.77 v99.06,64.77
N$26  (via drill 0.61)
  Top 0.254: JP4.2 IC3.8 20.32,35.56 21.59,36.83 v21.59,40.64
  Bottom 0.254: v21.59,40.64 IC3.6 | IC3.8 IC3.13
N$27
  Top 0.254: IC21.3 IC21.2
N$28
  Top 0.254: IC21.5 IC21.4
N$29  (via drill 0.61, 0.7)
  Top 0.254: v101.6,64.77 102.87,66.04 102.87,68.58 99.06,72.39 99.06,81.28 93.98,86.36 IC12.5 | IC22.19 v105.41,64.77
  Bottom 0.254: v105.41,64.77 v101.6,64.77
N$30
  Top 0.254: IC21.9 IC21.10
N$31  (via drill 0.61)
  Top 0.254: v115.57,59.69 115.57,80.01 116.84,81.28 IC13.9 | 115.57,50.8 v115.57,55.88 | JP6.1 115.57,50.8 | 115.57,50.8 JP6.3 JP6.5
  Bottom 0.254: v115.57,55.88 v115.57,59.69
N$32  (via drill 0.61)
  Top 0.254: v36.83,67.31 v36.83,63.5
  Bottom 0.254: v36.83,67.31 22.86,67.31 21.59,68.58 IC16.5 | v36.83,63.5 IC21.8
N$33  (via drill 0.61)
  Top 0.254: v21.59,86.36 15.24,80.01 15.24,67.31 16.51,66.04 IC16.6 | IC17.1 IC17.2
  Bottom 0.254: v21.59,86.36 30.48,86.36 IC17.1
N$34  (via drill 0.7)
  Top 0.254: IC17.13 33.02,96.52 34.29,97.79 58.42,97.79 58.42,74.93 57.15,73.66 57.15,72.39 58.42,71.12 v59.69,72.39 | v140.97,73.66 140.97,83.82 142.24,85.09 142.24,87.63 143.51,88.9 148.59,88.9 149.86,87.63 IC23.11
  Bottom 0.254: v59.69,72.39 73.66,72.39 74.93,73.66 v140.97,73.66
N$35  (via drill 0.61)
  Top 0.254: v29.21,66.04 v29.21,77.47 | v72.39,80.01 IC15.6
  Bottom 0.254: v29.21,77.47 54.61,77.47 57.15,80.01 v72.39,80.01 | IC16.9 v29.21,66.04
N$36  (via drill 0.61)
  Top 0.254: v87.63,91.44 87.63,90.17 86.36,88.9 IC12.2 | v93.98,91.44 IC12.12
  Bottom 0.254: v87.63,91.44 v93.98,91.44
N$37
  Top 0.254: IC12.13 91.44,93.98 92.71,92.71 92.71,91.44 93.98,90.17 99.06,90.17 IC12.7
N$38  (via drill 0.61)
  Top 0.254: v111.76,60.96 114.3,63.5 114.3,83.82 111.76,86.36 IC13.4 | JP3.1 JP3.3 JP3.5
  Bottom 0.254: JP3.1 v111.76,60.96
N$40
  Bottom 0.254: IC13.3 114.3,88.9 115.57,87.63 140.97,87.63 142.24,86.36 149.86,86.36 151.13,85.09 IC23.10
N$42
  Top 0.254: IC23.5 IC23.4
  Bottom 0.254: IC23.8 151.13,80.01 146.05,85.09 IC23.5
N$43  (via drill 0.61)
  Top 0.254: v129.54,88.9 129.54,82.55 128.27,81.28 IC14.6
  Bottom 0.254: v129.54,88.9 IC14.12
N$44  (via drill 0.61)
  Top 0.254: v82.55,78.74 83.82,77.47 87.63,77.47 87.63,81.28 v91.44,85.09 | IC22.40 v59.69,78.74
  Bottom 0.254: v91.44,85.09 107.95,85.09 109.22,83.82 IC13.5 | v59.69,78.74 v82.55,78.74
N$48  (via drill 0.61)
  Top 0.254: v128.27,71.12 129.54,72.39 v129.54,80.01 | v62.23,67.31 IC22.39
  Bottom 0.254: v129.54,80.01 124.46,80.01 120.65,83.82 IC13.10 | v62.23,67.31 72.39,67.31 74.93,69.85 100.33,69.85 101.6,71.12 v128.27,71.12
N$52  (via drill 0.61)
  Top 0.254: v48.26,71.12 48.26,72.39 49.53,73.66 49.53,90.17 44.45,90.17 43.18,88.9 IC17.6 | v96.52,71.12 97.79,72.39 IC22.25
  Bottom 0.254: v48.26,71.12 49.53,69.85 58.42,69.85 59.69,68.58 72.39,68.58 74.93,71.12 v96.52,71.12
N$54  (via drill 0.61)
  Top 0.254: v105.41,97.79 71.12,97.79 69.85,96.52 IC15.10
  Bottom 0.254: v105.41,97.79 153.67,97.79 156.21,95.25 156.21,93.98 158.75,93.98 158.75,90.17 IC23.12
N$55
  Bottom 0.254: IC17.11 38.1,93.98 39.37,92.71 41.91,92.71 43.18,93.98 IC17.9
N$57
  Top 0.254: R1.1 R4.1 | R2.1 R3.1 R5.1
  Bottom 0.254: R3.1 R1.1
PHI2  (via drill 0.61)
  Top 0.254: v46.99,69.85 46.99,72.39 48.26,73.66 v48.26,86.36 | v102.87,82.55 IC22.23 | IC15.1 v59.69,83.82
  Bottom 0.254: 22.86,69.85 20.32,72.39 11.43,72.39 U$1.C26 | 22.86,69.85 24.13,68.58 IC16.10 | v48.26,86.36 59.69,86.36 IC15.1 | 22.86,69.85 v46.99,69.85 | v102.87,82.55 91.44,82.55 90.17,83.82 v59.69,83.82
R/W  (via drill 0.61)
  Top 0.254: v33.02,91.44 35.56,93.98 IC17.12 | v21.59,91.44 13.97,83.82 13.97,74.93 U$1.C25 | v105.41,83.82 IC22.22 105.41,74.93 109.22,69.85 v109.22,50.8 | v72.39,91.44 IC15.9 | v87.63,38.1 87.63,34.29 86.36,33.02 86.36,31.75 85.09,30.48 86.36,29.21 IC9.1 | v97.79,39.37 v96.52,38.1 | v113.03,48.26 v113.03,41.91
  Bottom 0.254: v21.59,91.44 v33.02,91.44 38.1,91.44 39.37,90.17 58.42,90.17 59.69,91.44 v72.39,91.44 86.36,91.44 87.63,90.17 87.63,85.09 90.17,85.09 91.44,83.82 v105.41,83.82 | v96.52,38.1 v87.63,38.1 | v97.79,39.37 97.79,40.64 105.41,40.64 106.68,41.91 v113.03,41.91 | v113.03,48.26 110.49,50.8 v109.22,50.8
RA0  (via drill 0.61)
  Top 0.254: v110.49,67.31 v110.49,45.72 | v66.04,66.04 64.77,69.85 IC22.38 | v143.51,34.29 v143.51,13.97 | v120.65,35.56 114.3,41.91 v114.3,45.72
  Bottom 0.254: v66.04,66.04 73.66,66.04 74.93,67.31 100.33,67.31 101.6,68.58 109.22,68.58 v110.49,67.31 | IC8.3 93.98,46.99 95.25,45.72 v110.49,45.72 v114.3,45.72 | v143.51,34.29 142.24,35.56 v120.65,35.56 | v143.51,13.97 IC20.10
RA1  (via drill 0.61)
  Top 0.254: v144.78,38.1 146.05,36.83 v146.05,16.51 | IC22.37 67.31,68.58 73.66,62.23 73.66,59.69 74.93,58.42 v74.93,54.61 | v111.76,55.88 v111.76,38.1
  Bottom 0.254: v144.78,38.1 v111.76,38.1 97.79,38.1 96.52,39.37 IC8.6 | v146.05,16.51 IC20.9 | v74.93,54.61 93.98,54.61 95.25,55.88 v111.76,55.88
RA2  (via drill 0.7)
  Top 0.254: IC22.36 69.85,69.85 71.12,68.58 74.93,68.58 74.93,67.31 v76.2,66.04 | IC20.8 138.43,19.05 137.16,20.32 137.16,24.13 135.89,25.4 135.89,41.91 134.62,43.18 v134.62,59.69
  Bottom 0.254: v76.2,66.04 90.17,66.04 92.71,63.5 110.49,63.5 111.76,64.77 118.11,64.77 119.38,63.5 125.73,63.5 129.54,59.69 v134.62,59.69
SROUT  (via drill 0.61)
  Top 0.254: v134.62,71.12 134.62,63.5 135.89,62.23 IC10.13 | v111.76,69.85 106.68,74.93 106.68,80.01 107.95,81.28 107.95,90.17 109.22,91.44 IC13.2
  Bottom 0.254: v111.76,69.85 129.54,69.85 130.81,71.12 v134.62,71.12
VA0  (via drill 0.61)
  Top 0.254: v67.31,48.26 IC22.4
  Bottom 0.254: v67.31,48.26 57.15,48.26 55.88,49.53 IC6.2
VA1  (via drill 0.61)
  Top 0.254: v57.15,55.88 57.15,43.18 55.88,41.91 IC6.5 | v69.85,55.88 IC22.5
  Bottom 0.254: v57.15,55.88 v69.85,55.88
VA2  (via drill 0.61)
  Top 0.254: v67.31,39.37 69.85,41.91 69.85,54.61 72.39,57.15 IC22.6
  Bottom 0.254: IC6.11 v67.31,39.37
VA3  (via drill 0.61)
  Top 0.254: v67.31,46.99 68.58,48.26 v68.58,59.69
  Bottom 0.254: v68.58,59.69 73.66,59.69 IC22.7 | IC6.14 v67.31,46.99
VA4
  Top 0.254: IC22.8 77.47,52.07 74.93,49.53 IC7.2
VA5
  Top 0.254: IC22.9 78.74,59.69 78.74,52.07 76.2,49.53 76.2,43.18 74.93,41.91 IC7.5
VA6  (via drill 0.61)
  Top 0.254: v87.63,39.37 87.63,58.42 v86.36,59.69
  Bottom 0.254: v86.36,59.69 83.82,59.69 IC22.10 | IC7.11 v87.63,39.37
VA7  (via drill 0.61)
  Top 0.254: v86.36,46.99 86.36,58.42 85.09,59.69 IC22.11
  Bottom 0.254: IC7.14 v86.36,46.99
VA8  (via drill 0.61)
  Top 0.254: v52.07,63.5 52.07,48.26 53.34,46.99 IC6.3 | v85.09,63.5 IC22.12
  Bottom 0.254: v52.07,63.5 v85.09,63.5
VA9  (via drill 0.61)
  Top 0.254: v69.85,40.64 71.12,41.91 71.12,54.61 v72.39,55.88 | v90.17,55.88 IC22.13
  Bottom 0.254: v69.85,40.64 57.15,40.64 55.88,39.37 IC6.6 | v72.39,55.88 v90.17,55.88
VA10  (via drill 0.61)
  Top 0.254: v88.9,43.18 90.17,44.45 90.17,53.34 92.71,55.88 IC22.14
  Bottom 0.254: v88.9,43.18 78.74,43.18 76.2,40.64 71.12,40.64 68.58,38.1 64.77,38.1 63.5,36.83 IC6.10
VA11  (via drill 0.61)
  Top 0.254: v77.47,43.18 v77.47,46.99 | v95.25,48.26 IC22.15
  Bottom 0.254: v77.47,43.18 68.58,43.18 67.31,44.45 IC6.13 | v77.47,46.99 78.74,45.72 87.63,45.72 90.17,48.26 v95.25,48.26
VA12  (via drill 0.61)
  Top 0.254: v114.3,46.99 114.3,48.26 113.03,49.53 v113.03,55.88
  Bottom 0.254: v114.3,46.99 113.03,46.99 111.76,48.26 97.79,48.26 96.52,49.53 IC8.2 | v113.03,55.88 113.03,58.42 109.22,58.42 107.95,59.69 106.68,59.69 106.68,62.23 99.06,62.23 IC22.16
VA13  (via drill 0.61)
  Top 0.254: v96.52,54.61 96.52,44.45 93.98,41.91 IC8.5 | v99.06,54.61 100.33,57.15 IC22.17
  Bottom 0.254: v96.52,54.61 v99.06,54.61
VA14  (via drill 0.61)
  Top 0.254: v88.9,35.56 88.9,34.29 87.63,33.02 87.63,31.75 86.36,30.48 87.63,29.21 87.63,27.94 88.9,26.67 88.9,5.08 90.17,3.81 90.17,2.54 96.52,2.54 99.06,5.08 99.06,6.35 IC11.9
  Bottom 0.254: v88.9,35.56 83.82,35.56 82.55,36.83 IC7.10
VA15  (via drill 0.61)
  Top 0.254: v119.38,33.02 119.38,11.43 118.11,11.43 116.84,12.7 110.49,12.7 110.49,7.62 111.76,6.35 IC11.12 | v83.82,33.02 83.82,43.18 82.55,44.45 IC7.13
  Bottom 0.254: v119.38,33.02 v83.82,33.02
VCC  (via drill 0.61, 0.7)
  Top 0.254: IC3.20 C22.1 | C21.1 IC5.16 39.37,43.18 v39.37,26.67 41.91,26.67 IC4.16 | IC21.14 C1.1 | IC16.14 C13.1 26.67,83.82 26.67,90.17 30.48,93.98 IC17.14 C2.1 | IC12.1 IC12.16 C10.2 | v64.77,64.77 66.04,63.5 C11.1 | C16.2 53.34,73.66 54.61,74.93 v54.61,78.74 54.61,93.98 C20.2 | v77.47,86.36 76.2,88.9 74.93,90.17 71.12,90.17 68.58,92.71 68.58,97.79 59.69,97.79 IC15.14 | IC14.1 C9.2 | IC23.14 C4.1 | IC14.13 IC14.14 137.16,93.98 | 137.16,93.98 C15.1 | 137.16,93.98 137.16,85.09 135.89,83.82 IC14.10 | C8.2 IC10.16 | v120.65,86.36 120.65,77.47 119.38,76.2 119.38,66.04 120.65,64.77 120.65,62.23 JP3.6 | U$1.C2 U$1.C3 | IC2.6 16.51,8.89 v12.7,12.7 12.7,33.02 JP4.3 | IC2.16 C23.1 IC3.11 26.67,30.48 27.94,31.75 27.94,39.37 26.67,40.64 IC3.15 | C6.2 IC1.20 | IC20.27 IC20.28 C5.1 | IC11.20 C12.1 113.03,31.75 v118.11,36.83 | IC9.20 C3.1 | C17.2 73.66,7.62 69.85,3.81 IC19.9 | JP6.6 120.65,52.07 v120.65,36.83 | IC11.3 104.14,21.59 102.87,22.86 v102.87,27.94
  Bottom 0.254: IC3.20 26.67,53.34 27.94,52.07 JP1.1 31.75,52.07 33.02,50.8 40.64,50.8 C21.1 45.72,53.34 67.31,53.34 | IC4.16 C19.2 | C1.1 39.37,81.28 33.02,81.28 31.75,82.55 C13.1 | C7.2 IC7.16 80.01,52.07 78.74,53.34 67.31,53.34 | IC6.16 C11.1 67.31,53.34 | v64.77,64.77 C16.2 | v77.47,86.36 83.82,86.36 IC12.1 | v54.61,78.74 IC21.14 | IC14.10 130.81,83.82 128.27,86.36 IC14.4 v120.65,86.36 | C9.2 IC13.14 | C15.1 149.86,93.98 151.13,95.25 IC23.14 | IC14.14 IC14.1 | IC8.16 C14.1 106.68,54.61 120.65,54.61 | IC10.9 146.05,55.88 144.78,57.15 129.54,57.15 128.27,55.88 IC10.16 | JP6.6 120.65,54.61 | 120.65,54.61 C8.2 | 120.65,54.61 120.65,59.69 JP3.6 118.11,62.23 109.22,62.23 IC22.20 | C24.+ 13.97,6.35 16.51,8.89 IC2.6 | v12.7,12.7 U$1.C2 | JP4.3 15.24,33.02 15.24,31.75 22.86,31.75 24.13,30.48 IC3.11 | 147.32,36.83 IC20.1 v120.65,36.83 v118.11,36.83 | 147.32,36.83 IC20.28 | C6.2 132.08,33.02 143.51,33.02 147.32,36.83 | IC18.9 55.88,3.81 57.15,2.54 66.04,2.54 67.31,3.81 IC19.9 | 72.39,26.67 69.85,26.67 67.31,29.21 60.96,29.21 C18.2 54.61,27.94 53.34,26.67 v39.37,26.67 38.1,25.4 C23.1 | 72.39,26.67 C17.2 | 72.39,26.67 81.28,26.67 82.55,25.4 91.44,25.4 92.71,26.67 IC9.20 96.52,26.67 97.79,27.94 v102.87,27.94 110.49,27.94 111.76,26.67 IC11.20 | C20.2 IC15.14
VIDEO
  Top 0.254: R1.2 147.32,66.04 146.05,67.31 146.05,77.47 147.32,78.74 147.32,81.28 146.05,82.55 IC23.6
  Bottom 0.254: R1.2 148.59,64.77 151.13,67.31 153.67,67.31 X1.6 153.67,63.5
VSINV  (via drill 0.61)
  Top 0.254: v152.4,15.24 v152.4,27.94 | v156.21,39.37 156.21,44.45 157.48,45.72 157.48,54.61 156.21,55.88 v156.21,63.5 | v116.84,68.58 JP3.4
  Bottom 0.254: v152.4,15.24 119.38,15.24 118.11,13.97 IC11.15 | v152.4,27.94 157.48,27.94 157.48,39.37 v156.21,39.37 | v156.21,63.5 156.21,68.58 135.89,68.58 134.62,67.31 121.92,67.31 120.65,68.58 v116.84,68.58
VSYNC  (via drill 0.61)
  Top 0.254: JP5.2 157.48,66.04 154.94,63.5 154.94,57.15 153.67,55.88 X1.9 | v113.03,63.5 113.03,80.01 111.76,81.28 IC13.6 | v121.92,52.07 121.92,59.69 R2.2
  Bottom 0.254: R2.2 121.92,62.23 119.38,62.23 118.11,63.5 v113.03,63.5 | v121.92,52.07 123.19,50.8 153.67,50.8 X1.9 153.67,55.88
W/-R  (via drill 0.61)
  Top 0.254: v30.48,64.77 v30.48,76.2 | v49.53,64.77 50.8,66.04 v50.8,71.12 | v72.39,69.85 73.66,71.12 73.66,77.47 78.74,82.55 78.74,87.63 77.47,88.9 77.47,91.44 74.93,93.98 IC15.8
  Bottom 0.254: v30.48,64.77 v49.53,64.77 | v50.8,71.12 58.42,71.12 59.69,69.85 v72.39,69.85 | v30.48,76.2 IC16.13

## Text on the board
Top: CSA-VDC-1.3E | (C) A. Fachat